# EAGLE design detector_board (EAGLE 9.0.0)
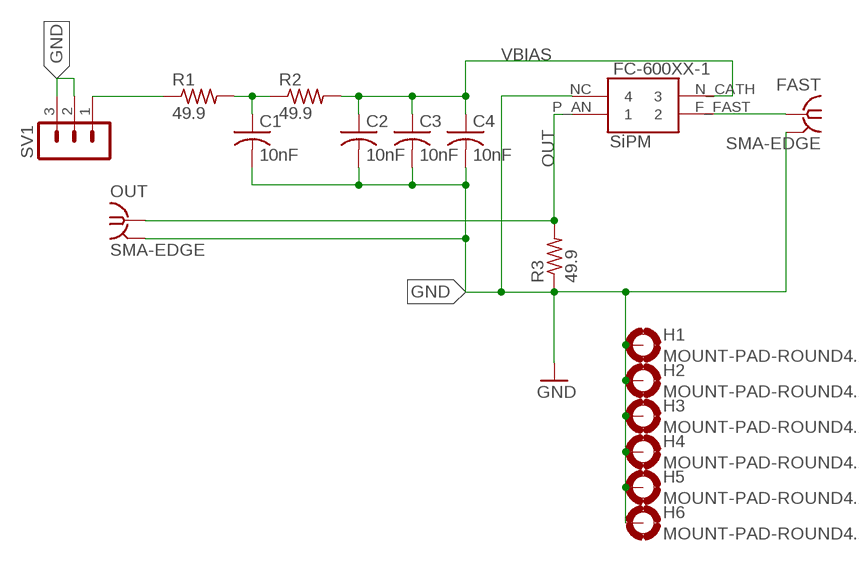
[diagram p0: schematic, sheet 1]

## Parts
C1  10nF  C-USC0603  [C0603]
C2  10nF  C-USC0603  [C0603]
C3  10nF  C-USC0603  [C0603]
C4  10nF  C-USC0603  [C0603]
FAST  SMA-EDGE  [SMA-EDGE]
FC-600XX-1  SiPM  FC-600XX  [FC-600XX-SMT_FULL]
H1  MOUNT-PAD-ROUND4.1  [4,1-PAD]
H2  MOUNT-PAD-ROUND4.1  [4,1-PAD]
H3  MOUNT-PAD-ROUND4.1  [4,1-PAD]
H4  MOUNT-PAD-ROUND4.1  [4,1-PAD]
H5  MOUNT-PAD-ROUND4.1  [4,1-PAD]
H6  MOUNT-PAD-ROUND4.1  [4,1-PAD]
OUT  SMA-EDGE  [SMA-EDGE]
R1  49.9  R-US_R0603  [R0603]
R2  49.9  R-US_R0603  [R0603]
R3  49.9  R-US_R0603  [R0603]
SV1  MA03-1  [MA03-1]

## Nets
FAST [high_freq]: FAST.G@0 FC-600XX-1.F_FAST
GND: C1.2 C2.2 C3.2 C4.2 FAST.G@1 FAST.G@2 FAST.G@3 FAST.G@4 FC-600XX-1.NC H1.B4,1(MOUNT) H2.B4,1(MOUNT) H3.B4,1(MOUNT) H4.B4,1(MOUNT) H5.B4,1(MOUNT) H6.B4,1(MOUNT) OUT.G@1 OUT.G@2 OUT.G@3 OUT.G@4 R3.1 SV1.2 SV1.3
IN: R1.1 SV1.1
OUT [high_freq]: FC-600XX-1.P_AN OUT.G@0 R3.2
P1: C1.1 R1.2 R2.1
VBIAS: C2.1 C3.1 C4.1 FC-600XX-1.N_CATH R2.2

## Library data of the parts
C1-C4 = rcl:C-US: CAPACITOR, American symbol; SPICEPREFIX: C
FAST = 000phys605parts:SMA-EDGE
FC-600XX-1 = 000phys605parts:FC-600XX
H1-H6 = holes:MOUNT-PAD-ROUND: MOUNTING PAD, round
OUT = 000phys605parts:SMA-EDGE; SPICEPREFIX: B
R1-R3 = rcl:R-US_: RESISTOR, American symbol; SPICEPREFIX: R
SV1 = con-lstb:MA03-1: PIN HEADER; OC_FARNELL: unknown; OC_NEWARK: unknown

## Net classes
0 default: width 0.305 mm, clearance 0.305 mm
1 high_freq: width 3 mm, clearance 0.508 mm to class 0, clearance 0.508 mm

## Board
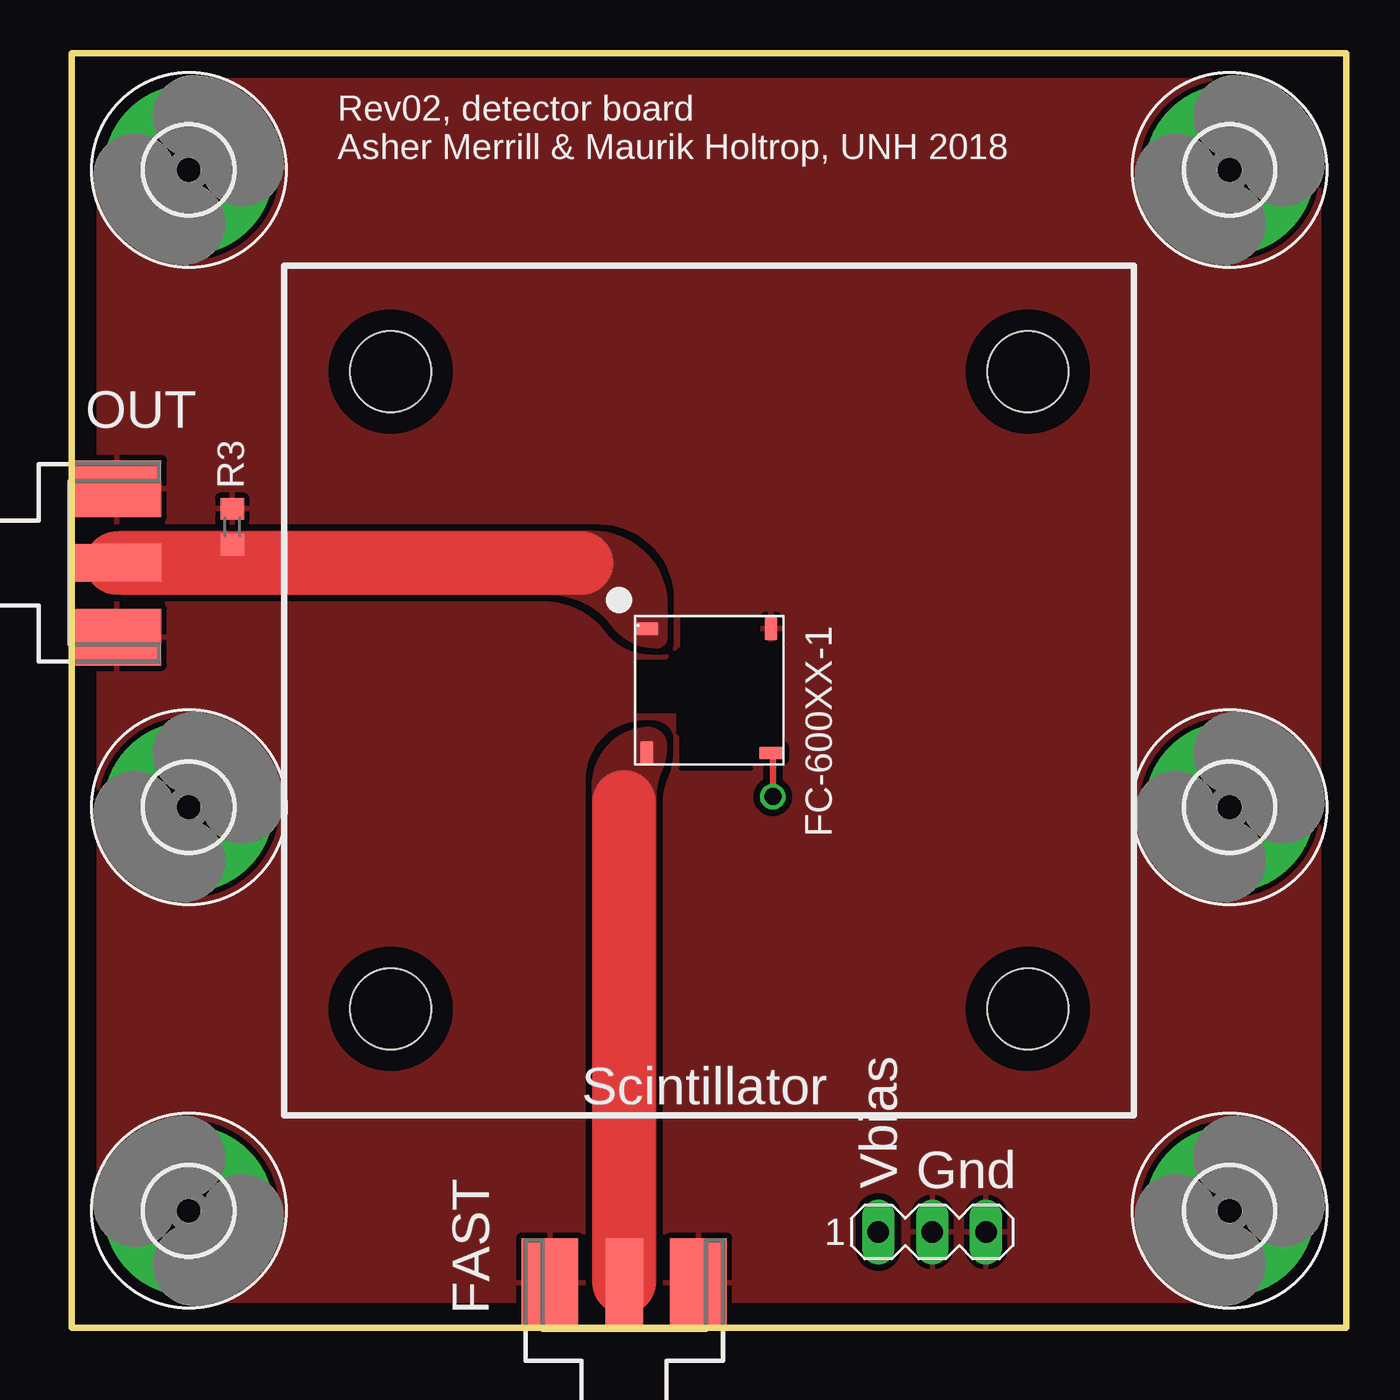
[diagram p1: board, top side]
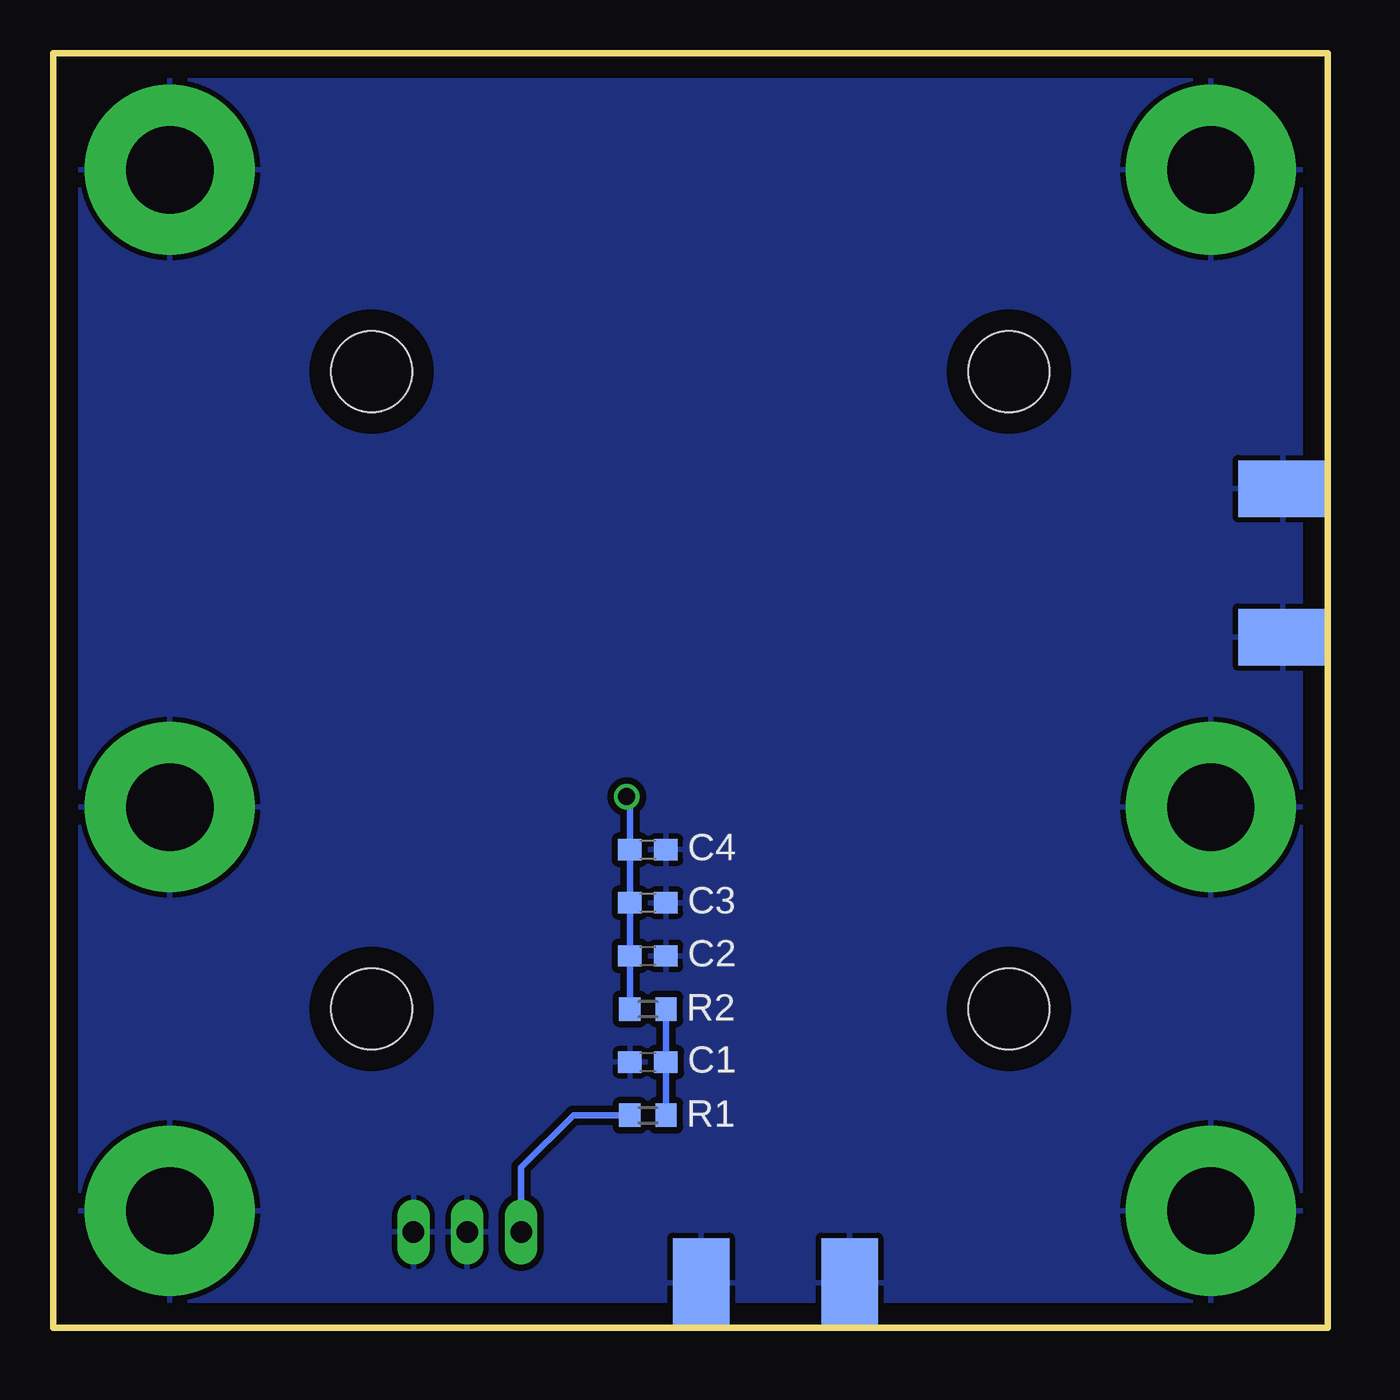
[diagram p2: board, bottom side, seen from below]

Size 60 x 60 mm. Coordinates in mm from the lower left corner, seen from the top.
Outline: 60,0 60,60 0,60 0,0 60,0
Copper layers (1*16): Top 0.035mm / dielectric 1.5mm / Bottom 0.035mm
Design rules "default": minimum track width 6mil, minimum drill 0.35mm, track to track 6mil, track to pad 6mil, pad to pad 6mil, via to via 6mil, smd to smd 6mil, copper to edge 40mil, drill to drill 6mil, minimum pad ring 10mil, minimum via ring 8mil, stop-mask expansion 4mil, vias tented up to drill 0mil, thermal gap 10mil
Holes 3.8 mm at 15,15 45,15 45,45 15,45
tRestrict: area 26.5,26.3 to 33.5,33.5

### Footprints (pad centres in the part's own frame; a part is rotated, then mirrored left to right if it is on the bottom)
C0603 = smd 1.1 x 1: 1 -0.85,0; 2 0.85,0
SMA-EDGE = smd 4.191 x 1.778: G@0 2.115,0 | smd 4.191 x 2.667: G@1 2.115,3.495; G@2 2.115,-3.495 | smd 4.191 x 2.667 bottom: G@3 2.115,3.495; G@4 2.115,-3.495
FC-600XX-SMT_FULL = smd 1.1 x 0.6: F_FAST 2.95,-2.94; NC -2.9,2.91 | smd 0.6 x 1.1: N_CATH 2.95,2.91; P_AN -2.9,-2.94
4,1-PAD = drill 4.1 pad 8: B4,1 0,0
R0603 = smd 1 x 1.1: 1 -0.85,0; 2 0.85,0
MA03-1 = drill 1.016 long: 1 -2.54,0; 2 0,0; 3 2.54,0

### Placement (x,y rotation side)
C1  32,12.5 180 bottom
C2  32,17.5 0 bottom
C3  32,20 0 bottom
C4  32,22.5 0 bottom
FAST  26,0 90 top
FC-600XX-1  30,30 270 top
H1  5.5,5.5 90 top
H2  54.5,5.5 0 top
H3  5.5,54.5 0 top
H4  54.5,54.5 0 top
H5  5.5,24.5 0 top
H6  54.5,24.5 0 top
OUT  0,36 0 top
R1  32,10 0 bottom
R2  32,15 180 bottom
R3  7.55,37.7 270 top
SV1  40.5,4.5 0 top

### Tracks (layer width: path | path; a pad name or v marks a point on that pad's centre or on a via)
FAST
  Top 3: FAST.G@0 26,24.75
  pour Top (isolate 0.508, no thermals): 27.5,2.25 27.5,25 arc-23 27.75,26.25 arc17 28,27.25 arc101 27,28.25 arc85 24.5,25.5 24.5,2.25 arc180
GND
  pour Top (rank 6): 0,60 60,60 60,0 0,0
  pour Bottom (rank 6): 0,60 60,60 60,0 0,0
IN
  Bottom 0.305: R1.1 35.5,10 37.96,7.54 SV1.1
OUT
  Top 3: OUT.G@0 24,36
  pour Top (isolate 0.508, no thermals): 23.5,37.5 24.5,37.5 arc-90 28,34 28,32.5 arc-90 27.5,32 arc-53 25.5,33 arc53 22.5,34.5 2.5,34.5 arc-180 2.5,37.5
P1
  Bottom 0.305: R1.2 C1.1 R2.1
VBIAS  (via drill 0.8)
  Top 0.305: FC-600XX-1.N_CATH 33,26.96 v33,25
  Bottom 0.305: R2.2 C2.1 C3.1 C4.1 32.85,24.85 v33,25

### Text on the board
tPlace: Rev02, detector board / Asher Merrill & Maurik Holtrop, UNH 2018 | Vbias | Gnd
tNames: Scintillator